# EAGLE schematic rp-schield (EAGLE 9.0.1)
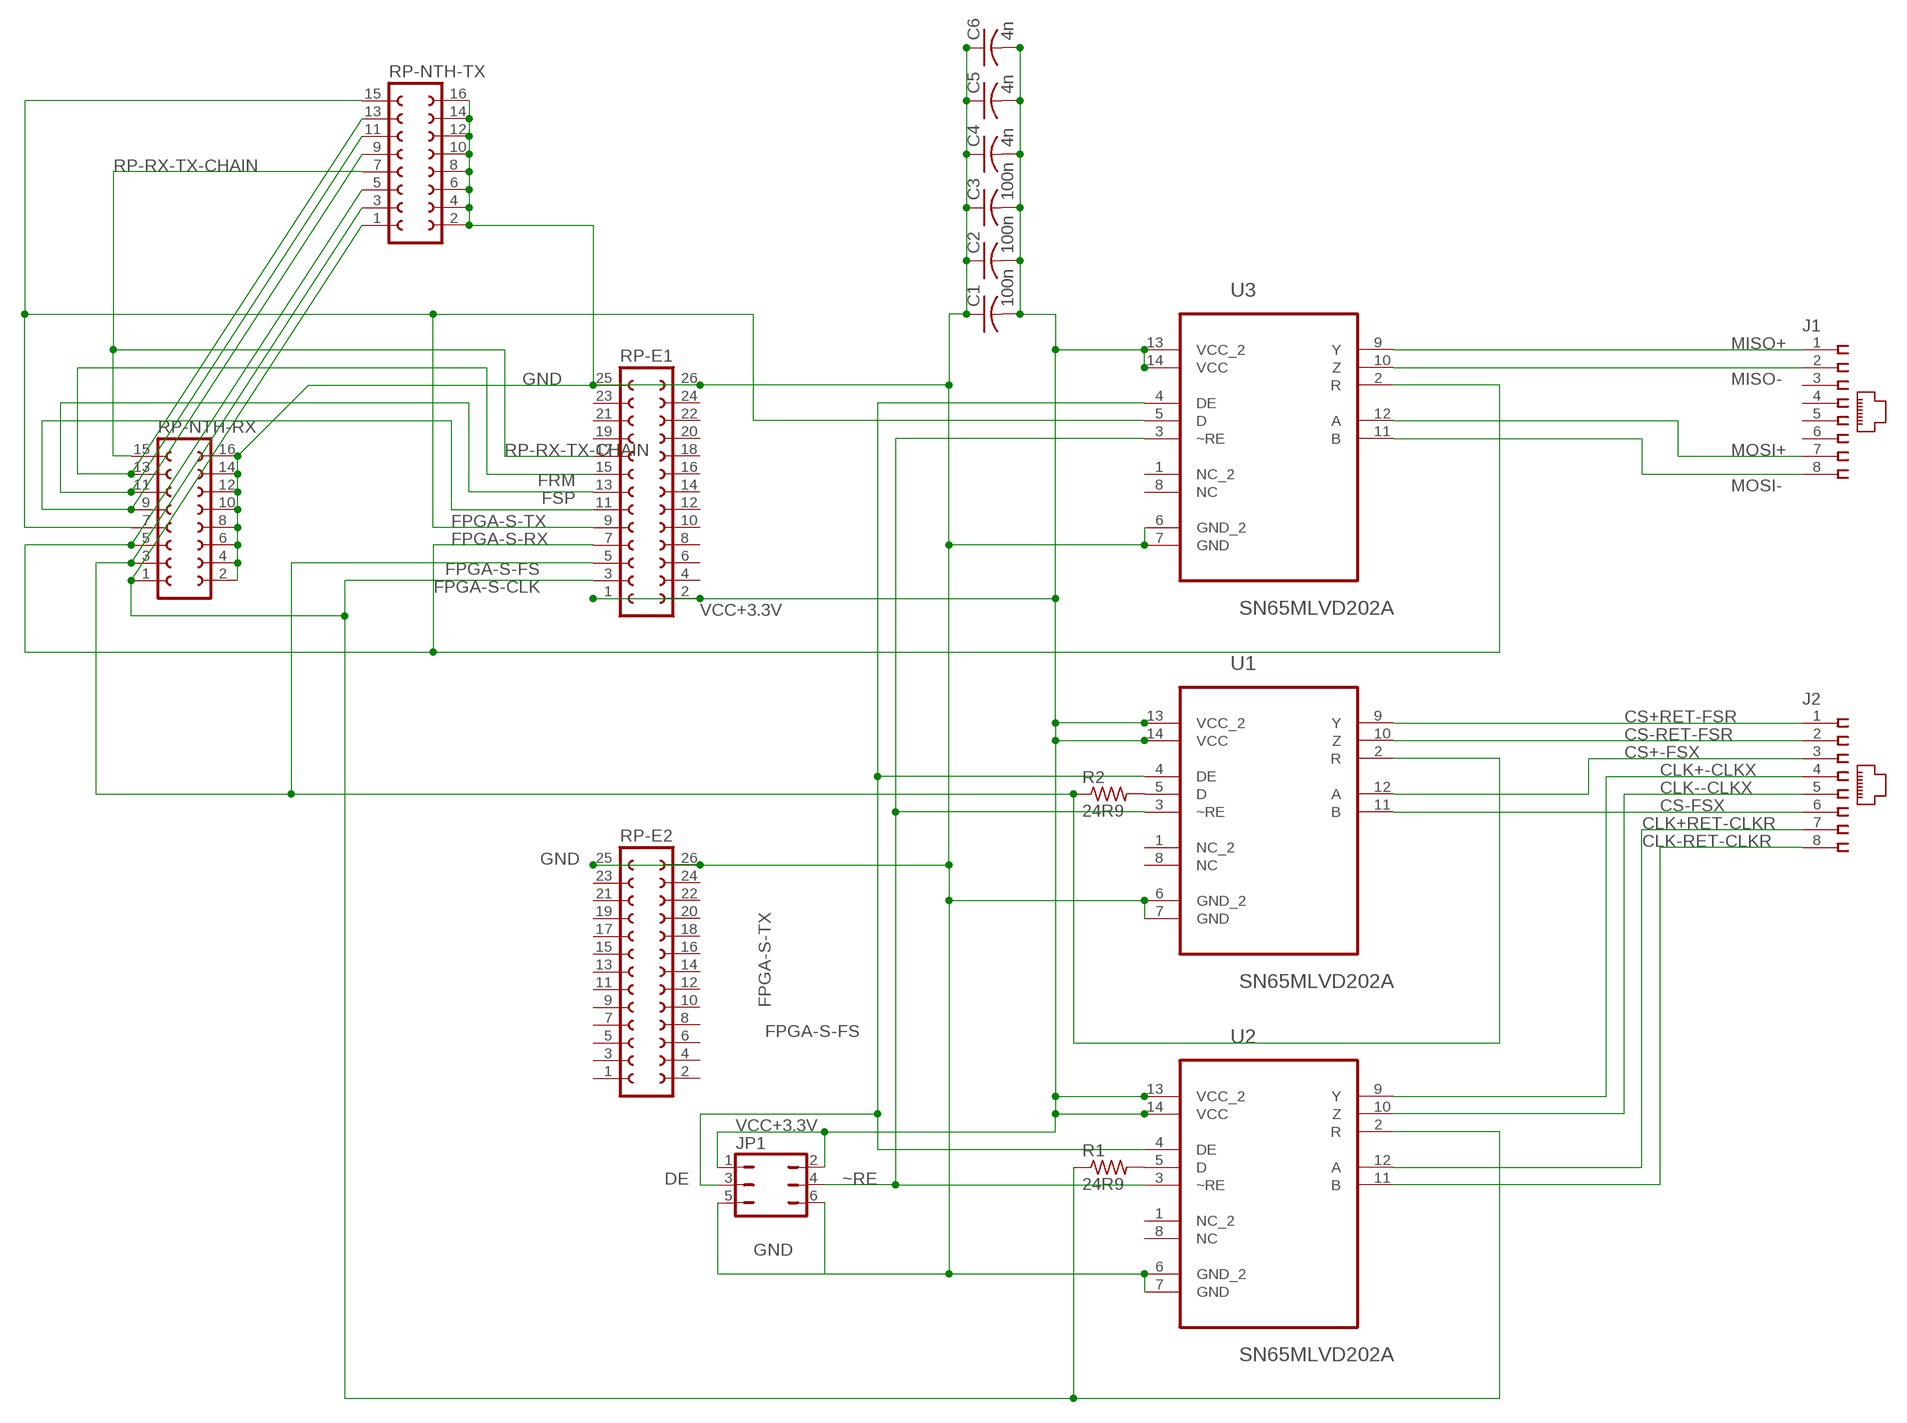
[diagram p0: schematic, sheet 1]

## Parts
C1  100n  C-USC0805  [C0805]
C2  100n  C-USC0805  [C0805]
C3  100n  C-USC0805  [C0805]
C4  4n  C-USC0805  [C0805]
C5  4n  C-USC0805  [C0805]
C6  4n  C-USC0805  [C0805]
J1  557785-1-SHIELD  [557785-1]
J2  557785-1-SHIELD  [557785-1]
JP1  JP3Q  [JP3Q]
R1  24R9  R-US_M1206  [M1206]
R2  24R9  R-US_M1206  [M1206]
RP-E1  FE13-2  [FE13-2]
RP-E2  FE13-2  [FE13-2]
RP-NTH-RX  FE08-2  [FE08-2]
RP-NTH-TX  FE08-2  [FE08-2]
U1  SN65MLVD202A  SN65MLVD205AD  [SOIC127P600X175-14N]
U2  SN65MLVD202A  SN65MLVD205AD  [SOIC127P600X175-14N]
U3  SN65MLVD202A  SN65MLVD205AD  [SOIC127P600X175-14N]

## Nets
CLK+-CLKX: J2.4 U2.9(Y)
CLK+RET-CLKR: J2.7 U2.12(A)
CLK--CLKX: J2.5 U2.10(Z)
CLK-RET-CLKR: J2.8 U2.11(B)
CS+-FSX: J2.3 U1.12(A)
CS+RET-FSR: J2.1 U1.9(Y)
CS-FSX: J2.6 U1.11(B)
CS-RET-FSR: J2.2 U1.10(Z)
DE: JP1.3 U1.4(DE) U2.4(DE) U3.4(DE)
FPGA-S-CLK: R1.1 RP-E1.3 RP-NTH-RX.1 RP-NTH-TX.1 U2.2(R)
FPGA-S-FS: R2.1 RP-E1.5 RP-NTH-RX.3 RP-NTH-TX.3 U1.2(R)
FPGA-S-RX: RP-E1.7 RP-NTH-RX.5 RP-NTH-TX.5 U3.2(R)
FPGA-S-TX: RP-E1.9 RP-NTH-RX.7 RP-NTH-TX.15 U3.5(D)
FRM: RP-E1.13 RP-NTH-RX.11 RP-NTH-TX.11
FSP: RP-E1.11 RP-NTH-RX.9 RP-NTH-TX.9
GND: C1.1 C2.1 C3.1 C4.1 C5.1 C6.1 JP1.5 JP1.6 RP-E1.25 RP-E1.26 RP-E2.25 RP-E2.26 RP-NTH-RX.2 RP-NTH-RX.4 RP-NTH-RX.6 RP-NTH-RX.8 RP-NTH-RX.10 RP-NTH-RX.12 RP-NTH-RX.14 RP-NTH-RX.16 RP-NTH-TX.2 RP-NTH-TX.4 RP-NTH-TX.6 RP-NTH-TX.8 RP-NTH-TX.10 RP-NTH-TX.12 RP-NTH-TX.14 RP-NTH-TX.16 U1.6(GND_2) U1.7(GND) U2.6(GND_2) U2.7(GND) U3.6(GND_2) U3.7(GND)
MISO+: J1.1 U3.9(Y)
MISO-: J1.2 U3.10(Z)
MOSI+: J1.7 U3.12(A)
MOSI-: J1.8 U3.11(B)
N$2: R1.2 U2.5(D)
N$6: R2.2 U1.5(D)
N$10: RP-E1.15 RP-NTH-RX.13 RP-NTH-TX.13
RP-RX-TX-CHAIN: RP-E1.17 RP-NTH-RX.15 RP-NTH-TX.7
VCC+3.3V: C1.2 C2.2 C3.2 C4.2 C5.2 C6.2 JP1.1 JP1.2 RP-E1.1 RP-E1.2 U1.13(VCC_2) U1.14(VCC) U2.13(VCC_2) U2.14(VCC) U3.13(VCC_2) U3.14(VCC)
~RE: JP1.4 U1.3(~RE) U2.3(~RE) U3.3(~RE)
Unconnected: J1.3 J1.4 J1.5 J1.6 RP-E1.4 RP-E1.6 RP-E1.8 RP-E1.10 RP-E1.12 RP-E1.14 RP-E1.16 RP-E1.18 RP-E1.19 RP-E1.20 RP-E1.21 RP-E1.22 RP-E1.23 RP-E1.24 RP-E2.1 RP-E2.2 RP-E2.3 RP-E2.4 RP-E2.5 RP-E2.6 RP-E2.7 RP-E2.8 RP-E2.9 RP-E2.10 RP-E2.11 RP-E2.12 RP-E2.13 RP-E2.14 RP-E2.15 RP-E2.16 RP-E2.17 RP-E2.18 RP-E2.19 RP-E2.20 RP-E2.21 RP-E2.22 RP-E2.23 RP-E2.24 U1.1(NC_2) U1.8(NC) U2.1(NC_2) U2.8(NC) U3.1(NC_2) U3.8(NC)

## Library data of the parts
C1-C6 = resistor:C-US: CAPACITOR, American symbol
J1 J2 = con-amp-rj45-shield:557785-1-SHIELD: AMP connector
JP1 = jumper:JP3Q: JUMPER
R1 R2 = resistor:R-US_: RESISTOR, American symbol
RP-E1 RP-E2 = con-lsta:FE13-2: FEMALE HEADER; OC_FARNELL: unknown; OC_NEWARK: unknown
RP-NTH-RX RP-NTH-TX = con-lsta:FE08-2: FEMALE HEADER; OC_FARNELL: unknown; OC_NEWARK: unknown
U1-U3 = Texas Instruments_By_element14_Batch_1:SN65MLVD205AD: MULTIPOINT-LVDS LINE DRIVER AND RECEIVER; MPN: SN65MLVD205AD; OC_FARNELL: 90H3613; OC_NEWARK: -; PACKAGE: SOIC-14; SUPPLIER: TEXAS INSTRUMENTS